# EAGLE design Aerothrust_Module_Stm32_PCB (EAGLE 7.6.0)
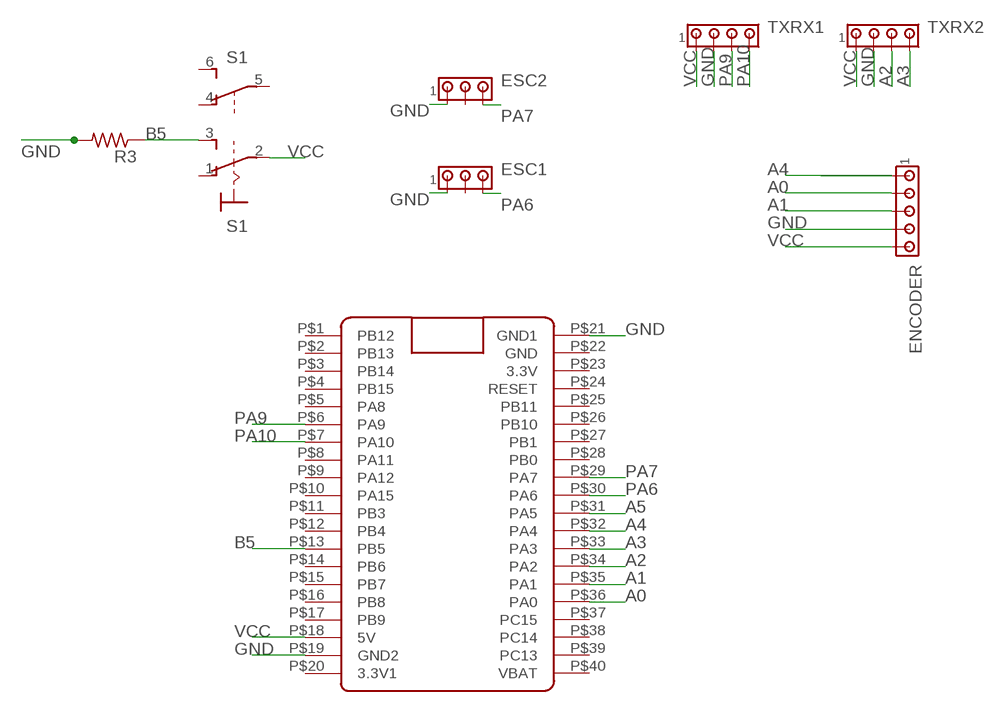
[diagram p0: schematic, sheet 1]

## Parts
ENCODER  MTA05-100  [10X05MTA]
ESC1  MTA03-100  [10X03MTA]
ESC2  MTA03-100  [10X03MTA]
R3  R-US_0207/10  [0207/10]
S1  320-938  [320-938]
TXRX1  MTA04-100  [10X04MTA]
TXRX2  MTA04-100  [10X04MTA]
U$1  BLUE_PILL  [BLUE_PILL]

## Nets
A0: ENCODER.2 U$1.P$36(PA0)
A1: ENCODER.3 U$1.P$35(PA1)
A2: TXRX2.3 U$1.P$34(PA2)
A3: TXRX2.4 U$1.P$33(PA3)
A4: ENCODER.1 U$1.P$32(PA4)
A5: U$1.P$31(PA5)
B5: R3.1 S1.3(1:S) U$1.P$13(PB5)
GND: ENCODER.4 ESC1.1 ESC2.1 R3.2 TXRX1.2 TXRX2.2 U$1.P$19(GND2) U$1.P$21(GND1)
PA6: ESC1.3 U$1.P$30(PA6)
PA7: ESC2.3 U$1.P$29(PA7)
PA9: TXRX1.3 U$1.P$6(PA9)
PA10: TXRX1.4 U$1.P$7(PA10)
VCC: ENCODER.5 S1.2(1:P) TXRX1.1 TXRX2.1 U$1.P$18(5V)
Unconnected: ESC1.2 ESC2.2 S1.1(1:O) S1.4(B:O) S1.5(B:P) S1.6(B:S) U$1.P$1(PB12) U$1.P$2(PB13) U$1.P$3(PB14) U$1.P$4(PB15) U$1.P$5(PA8) U$1.P$8(PA11) U$1.P$9(PA12) U$1.P$10(PA15) U$1.P$11(PB3) U$1.P$12(PB4) U$1.P$14(PB6) U$1.P$15(PB7) U$1.P$16(PB8) U$1.P$17(PB9) U$1.P$20(3.3V1) U$1.P$22(GND) U$1.P$23(3.3V) U$1.P$24(RESET) U$1.P$25(PB11) U$1.P$26(PB10) U$1.P$27(PB1) U$1.P$28(PB0) U$1.P$37(PC15) U$1.P$38(PC14) U$1.P$39(PC13) U$1.P$40(VBAT)

## Library data of the parts
ENCODER = con-amp:MTA05-100: AMP connector
ESC1 ESC2 = con-amp:MTA03-100: AMP connector
R3 = adafruit:R-US_: RESISTOR, American symbol
S1 = Kuber_Toggle_Switch:320-938: TOGGLE SWITCH distributor RS Components
TXRX1 TXRX2 = con-amp:MTA04-100: AMP connector
U$1 = BluePill:BLUE_PILL

## Net classes
0 default: clearance 0.205 mm

## Board
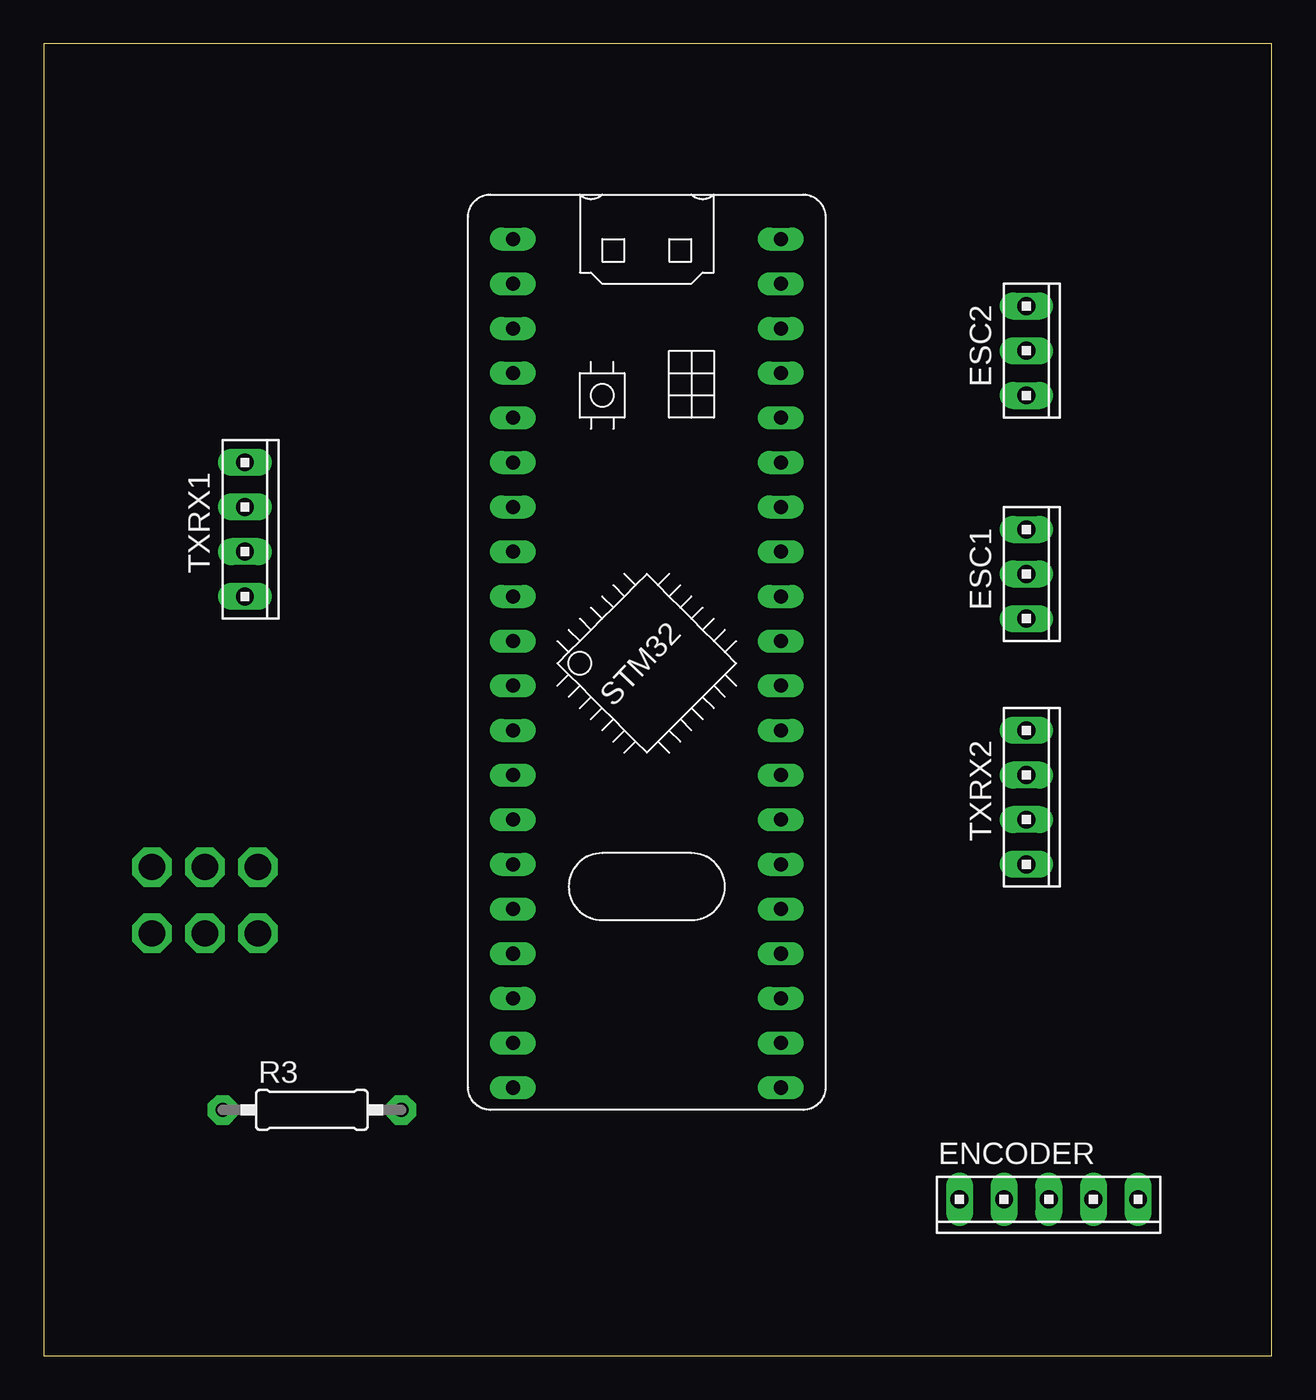
[diagram p1: board, top side]
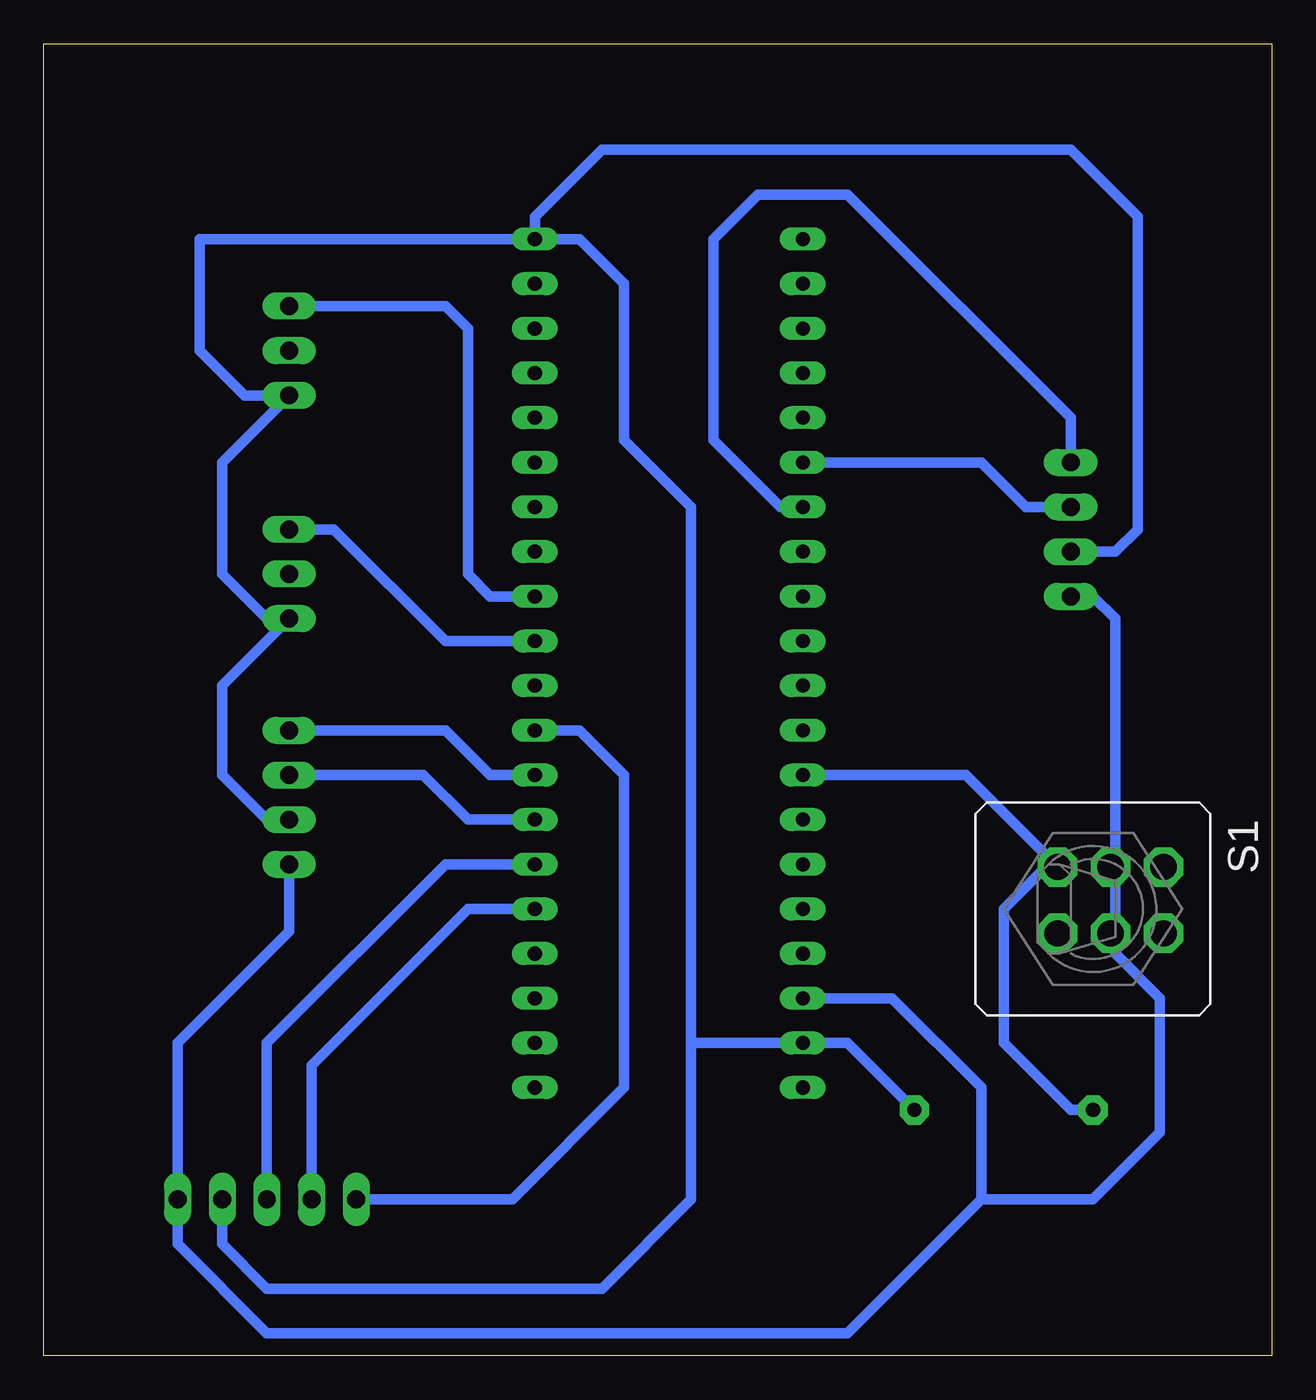
[diagram p2: board, bottom side, seen from below]

Size 69.83 x 74.6 mm. Coordinates in mm from the lower left corner, seen from the top.
Outline: 0,0 69.83,0 69.83,74.6 0,74.6 0,0
Copper layers (1*16): Top 0.035mm / dielectric 1.5mm / Bottom 0.035mm
Design rules "default *": minimum track width 10mil, minimum drill 24mil, track to track 20mil, track to pad 20mil, pad to pad 20mil, via to via 20mil, smd to smd 8mil, copper to edge 40mil, drill to drill 8mil, minimum pad ring 10mil, minimum via ring 8mil, stop-mask expansion 4mil, vias tented up to drill 0mil, thermal gap 10mil

### Footprints (pad centres in the part's own frame; a part is rotated, then mirrored left to right if it is on the bottom)
10X05MTA = drill 1.016 long: 1 5.08,0; 2 2.54,0; 3 0,0; 4 -2.54,0; 5 -5.08,0
10X03MTA = drill 1.016 long: 1 2.54,0; 2 0,0; 3 -2.54,0
0207/10 = drill 0.813 pad 1.676 octagon: 1 -5.08,0; 2 5.08,0
320-938 = drill 1.499 octagon: 1 -2.388,4.013; 2 -2.388,1; 3 -2.388,-2.013; 4 1.388,4.013; 5 1.388,1; 6 1.388,-2.013
10X04MTA = drill 1.016 long: 1 3.81,0; 2 1.27,0; 3 -1.27,0; 4 -3.81,0
BLUE_PILL = drill 0.8 long: P$1 -7.62,15.24; P$2 -7.62,12.7; P$3 -7.62,10.16; P$4 -7.62,7.62; P$5 -7.62,5.08; P$6 -7.62,2.54; P$7 -7.62,0; P$8 -7.62,-2.54; P$9 -7.62,-5.08; P$10 -7.62,-7.62; P$11 -7.62,-10.16; P$12 -7.62,-12.7; P$13 -7.62,-15.24; P$14 -7.62,-17.78; P$15 -7.62,-20.32; P$16 -7.62,-22.86; P$17 -7.62,-25.4; P$18 -7.62,-27.94; P$19 -7.62,-30.48; P$20 -7.62,-33.02; P$21 7.62,15.24; P$22 7.62,12.7; P$23 7.62,10.16; P$24 7.62,7.62; P$25 7.62,5.08; P$26 7.62,2.54; P$27 7.62,0; P$28 7.62,-2.54; P$29 7.62,-5.08; P$30 7.62,-7.62; P$31 7.62,-10.16; P$32 7.62,-12.7; P$33 7.62,-15.24; P$34 7.62,-17.78; P$35 7.62,-20.32; P$36 7.62,-22.86; P$37 7.62,-25.4; P$38 7.62,-27.94; P$39 7.62,-30.48; P$40 7.62,-33.02

### Placement (x,y rotation side)
ENCODER  57.15,8.89 180 top
ESC1  55.88,44.45 270 top
ESC2  55.88,57.15 270 top
R3  15.24,13.97 0 top
S1  10.16,25.4 270 bottom
TXRX1  11.43,46.99 270 top
TXRX2  55.88,31.75 270 top
U$1  34.29,48.26 0 top

### Tracks (layer width: path | path; a pad name or v marks a point on that pad's centre or on a via)
A0
  Bottom 0.61: U$1.P$36 45.72,25.4 54.61,16.51 ENCODER.2
A1
  Bottom 0.61: U$1.P$35 46.99,27.94 57.15,17.78 ENCODER.3
A2
  Bottom 0.61: U$1.P$34 45.72,30.48 48.26,33.02 TXRX2.3
A3
  Bottom 0.61: U$1.P$33 44.45,33.02 46.99,35.56 TXRX2.4
A4
  Bottom 0.61: U$1.P$32 39.37,35.56 36.83,33.02 36.83,15.24 43.18,8.89 ENCODER.1
B5
  Bottom 0.61: U$1.P$13 17.41,33.02 S1.3 12.85,27.79 15.24,25.4 15.24,17.78 11.43,13.97 R3.1
GND
  Bottom 0.61: TXRX2.2 57.15,30.48 59.69,33.02 59.69,38.1 ESC1.1 57.15,41.91 59.69,44.45 59.69,50.8 ESC2.1 58.42,54.61 60.96,57.15 60.96,63.5 U$1.P$21 | R3.2 24.13,17.78 U$1.P$19 33.02,17.78 | U$1.P$21 41.91,64.77 38.1,68.58 11.43,68.58 7.62,64.77 7.62,46.99 8.89,45.72 TXRX1.2 | ENCODER.4 59.69,6.35 57.15,3.81 38.1,3.81 33.02,8.89 33.02,17.78 | 33.02,17.78 33.02,48.26 36.83,52.07 36.83,60.96 39.37,63.5 U$1.P$21
PA6
  Bottom 0.61: U$1.P$30 46.99,40.64 53.34,46.99 ESC1.3
PA7
  Bottom 0.61: ESC2.3 46.99,59.69 45.72,58.42 45.72,44.45 44.45,43.18 U$1.P$29
PA9
  Bottom 0.61: TXRX1.3 13.97,48.26 16.51,50.8 U$1.P$6
PA10
  Bottom 0.61: U$1.P$7 27.94,48.26 31.75,52.07 31.75,63.5 29.21,66.04 24.13,66.04 11.43,53.34 TXRX1.4
VCC
  Bottom 0.61: TXRX2.1 55.88,24.13 62.23,17.78 ENCODER.5 62.23,6.35 57.15,1.27 24.13,1.27 16.51,8.89 | U$1.P$18 21.59,20.32 16.51,15.24 16.51,8.89 | TXRX1.1 10.16,43.18 8.89,41.91 8.89,27.94 9.04,27.79 S1.2 8.89,27.52 8.89,22.86 6.35,20.32 6.35,12.7 10.16,8.89 16.51,8.89